# EAGLE design dot_matrix (EAGLE 5.07)
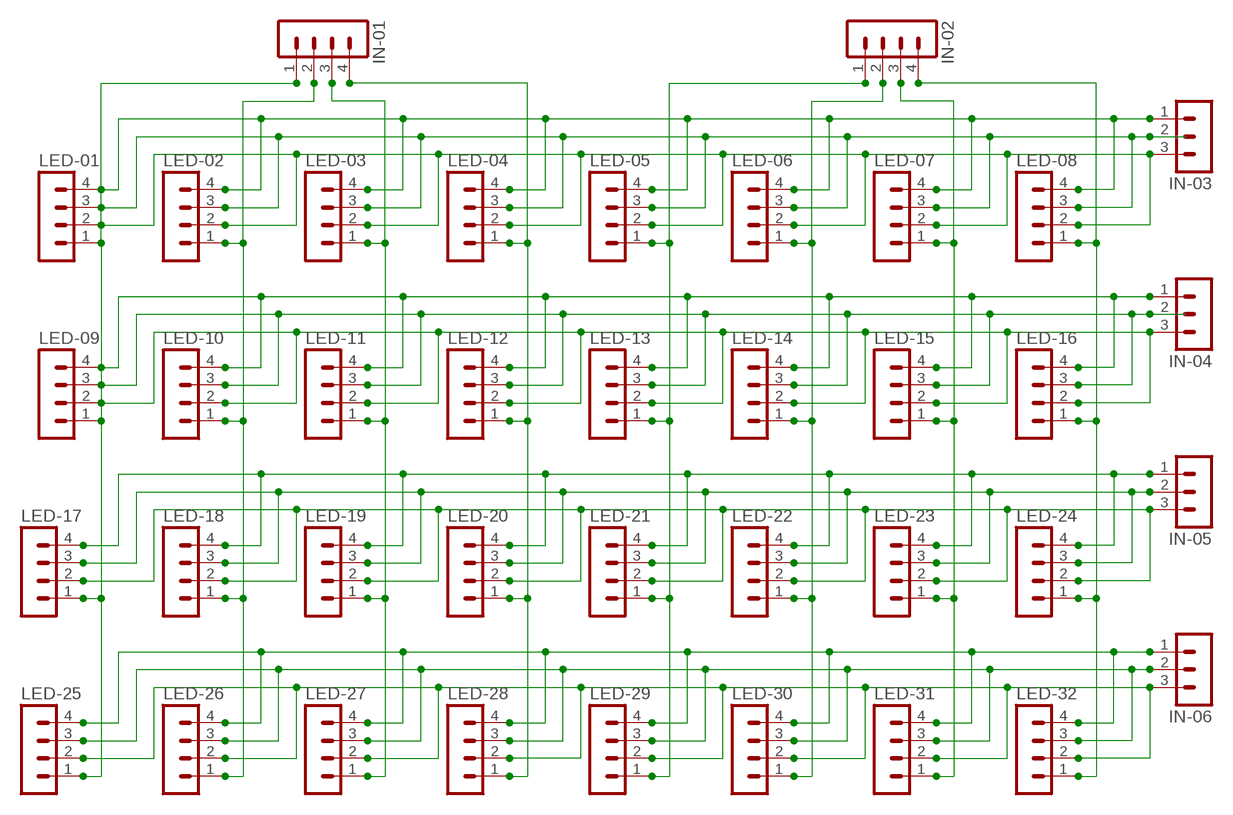
[diagram p0: schematic, sheet 1]

## Parts
IN-01  MA04-1  [MA04-1]
IN-02  MA04-1  [MA04-1]
IN-03  MA03-1  [MA03-1]
IN-04  MA03-1  [MA03-1]
IN-05  MA03-1  [MA03-1]
IN-06  MA03-1  [MA03-1]
LED-01  MA04-1  [MA04-1]
LED-02  MA04-1  [MA04-1]
LED-03  MA04-1  [MA04-1]
LED-04  MA04-1  [MA04-1]
LED-05  MA04-1  [MA04-1]
LED-06  MA04-1  [MA04-1]
LED-07  MA04-1  [MA04-1]
LED-08  MA04-1  [MA04-1]
LED-09  MA04-1  [MA04-1]
LED-10  MA04-1  [MA04-1]
LED-11  MA04-1  [MA04-1]
LED-12  MA04-1  [MA04-1]
LED-13  MA04-1  [MA04-1]
LED-14  MA04-1  [MA04-1]
LED-15  MA04-1  [MA04-1]
LED-16  MA04-1  [MA04-1]
LED-17  MA04-1  [MA04-1]
LED-18  MA04-1  [MA04-1]
LED-19  MA04-1  [MA04-1]
LED-20  MA04-1  [MA04-1]
LED-21  MA04-1  [MA04-1]
LED-22  MA04-1  [MA04-1]
LED-23  MA04-1  [MA04-1]
LED-24  MA04-1  [MA04-1]
LED-25  MA04-1  [MA04-1]
LED-26  MA04-1  [MA04-1]
LED-27  MA04-1  [MA04-1]
LED-28  MA04-1  [MA04-1]
LED-29  MA04-1  [MA04-1]
LED-30  MA04-1  [MA04-1]
LED-31  MA04-1  [MA04-1]
LED-32  MA04-1  [MA04-1]

## Nets
N$1: IN-06.3 LED-25.2 LED-26.2 LED-27.2 LED-28.2 LED-29.2 LED-30.2 LED-31.2 LED-32.2
N$2: IN-03.3 LED-01.2 LED-02.2 LED-03.2 LED-04.2 LED-05.2 LED-06.2 LED-07.2 LED-08.2
N$3: IN-03.2 LED-01.3 LED-02.3 LED-03.3 LED-04.3 LED-05.3 LED-06.3 LED-07.3 LED-08.3
N$4: IN-03.1 LED-01.4 LED-02.4 LED-03.4 LED-04.4 LED-05.4 LED-06.4 LED-07.4 LED-08.4
N$5: IN-04.3 LED-09.2 LED-10.2 LED-11.2 LED-12.2 LED-13.2 LED-14.2 LED-15.2 LED-16.2
N$6: IN-01.4 LED-04.1 LED-12.1 LED-20.1 LED-28.1
N$7: IN-06.1 LED-25.4 LED-26.4 LED-27.4 LED-28.4 LED-29.4 LED-30.4 LED-31.4 LED-32.4
N$9: IN-01.2 LED-02.1 LED-10.1 LED-18.1 LED-26.1
N$12: IN-04.2 LED-09.3 LED-10.3 LED-11.3 LED-12.3 LED-13.3 LED-14.3 LED-15.3 LED-16.3
N$13: IN-01.3 LED-03.1 LED-11.1 LED-19.1 LED-27.1
N$14: IN-04.1 LED-09.4 LED-10.4 LED-11.4 LED-12.4 LED-13.4 LED-14.4 LED-15.4 LED-16.4
N$15: IN-05.3 LED-17.2 LED-18.2 LED-19.2 LED-20.2 LED-21.2 LED-22.2 LED-23.2 LED-24.2
N$16: IN-05.2 LED-17.3 LED-18.3 LED-19.3 LED-20.3 LED-21.3 LED-22.3 LED-23.3 LED-24.3
N$17: IN-05.1 LED-17.4 LED-18.4 LED-19.4 LED-20.4 LED-21.4 LED-22.4 LED-23.4 LED-24.4
N$27: IN-01.1 LED-01.1 LED-09.1 LED-17.1 LED-25.1
N$35: IN-02.1 LED-05.1 LED-13.1 LED-21.1 LED-29.1
N$36: IN-02.2 LED-06.1 LED-14.1 LED-22.1 LED-30.1
N$37: IN-02.3 LED-07.1 LED-15.1 LED-23.1 LED-31.1
N$38: IN-02.4 LED-08.1 LED-16.1 LED-24.1 LED-32.1
N$46: IN-06.2 LED-25.3 LED-26.3 LED-27.3 LED-28.3 LED-29.3 LED-30.3 LED-31.3 LED-32.3

## Library data of the parts
IN-01 IN-02 LED-01-LED-09 LED-10-LED-32 = con-lstb:MA04-1: PIN HEADER
IN-03-IN-06 = con-lstb:MA03-1: PIN HEADER

## Board
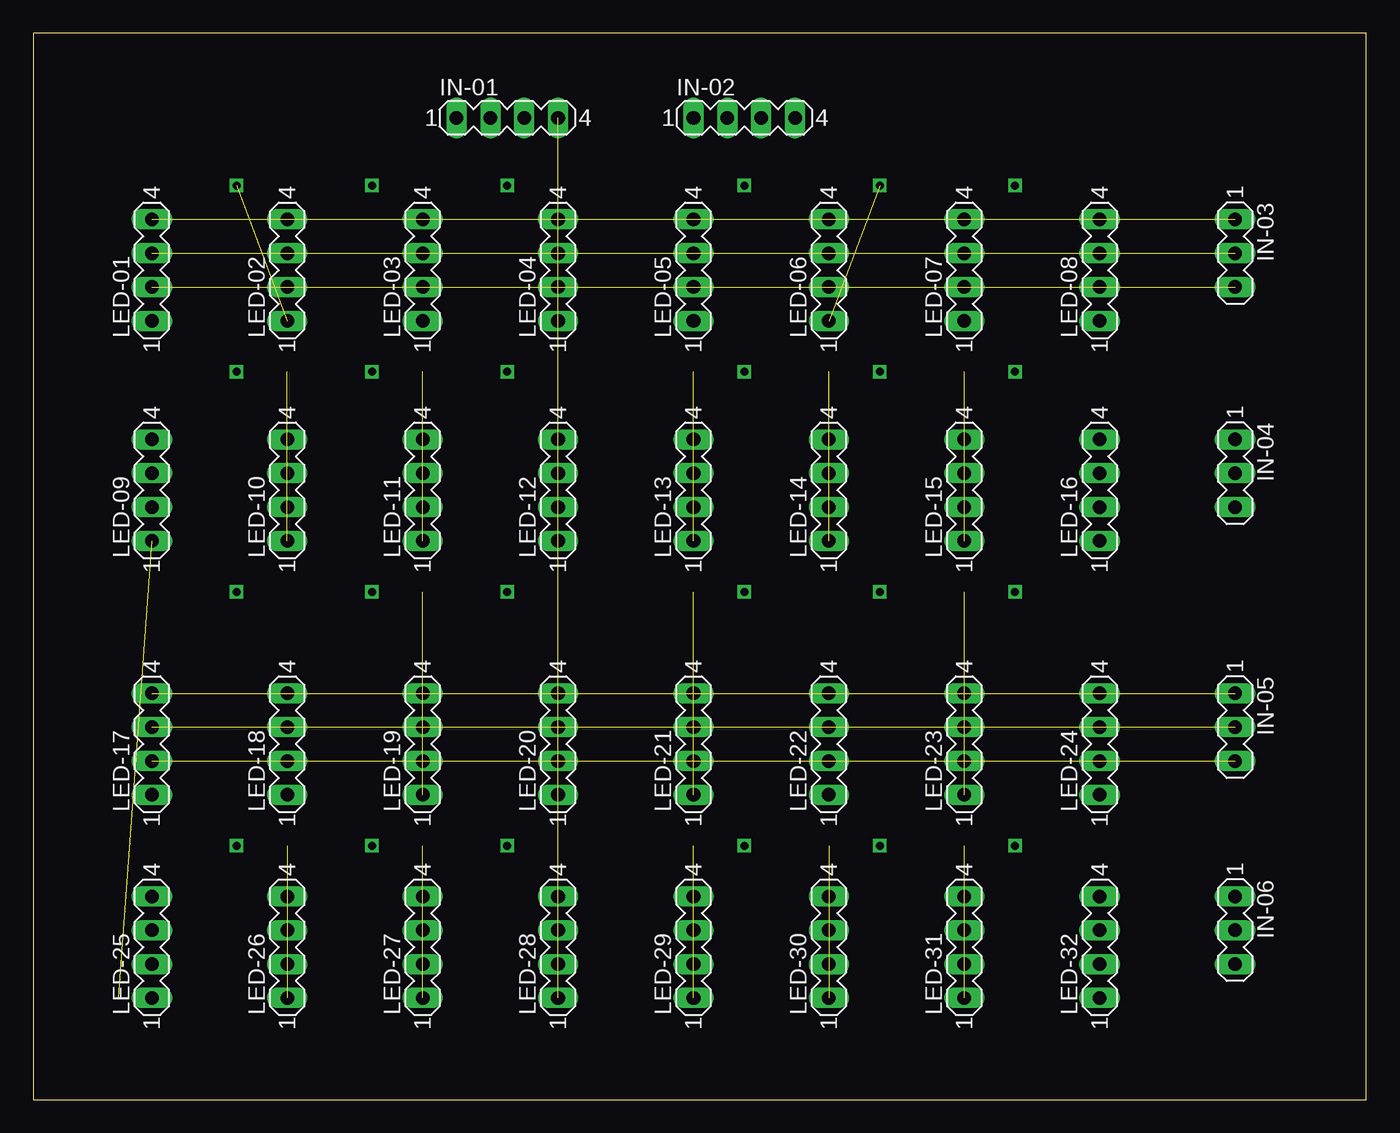
[diagram p1: board, top side]
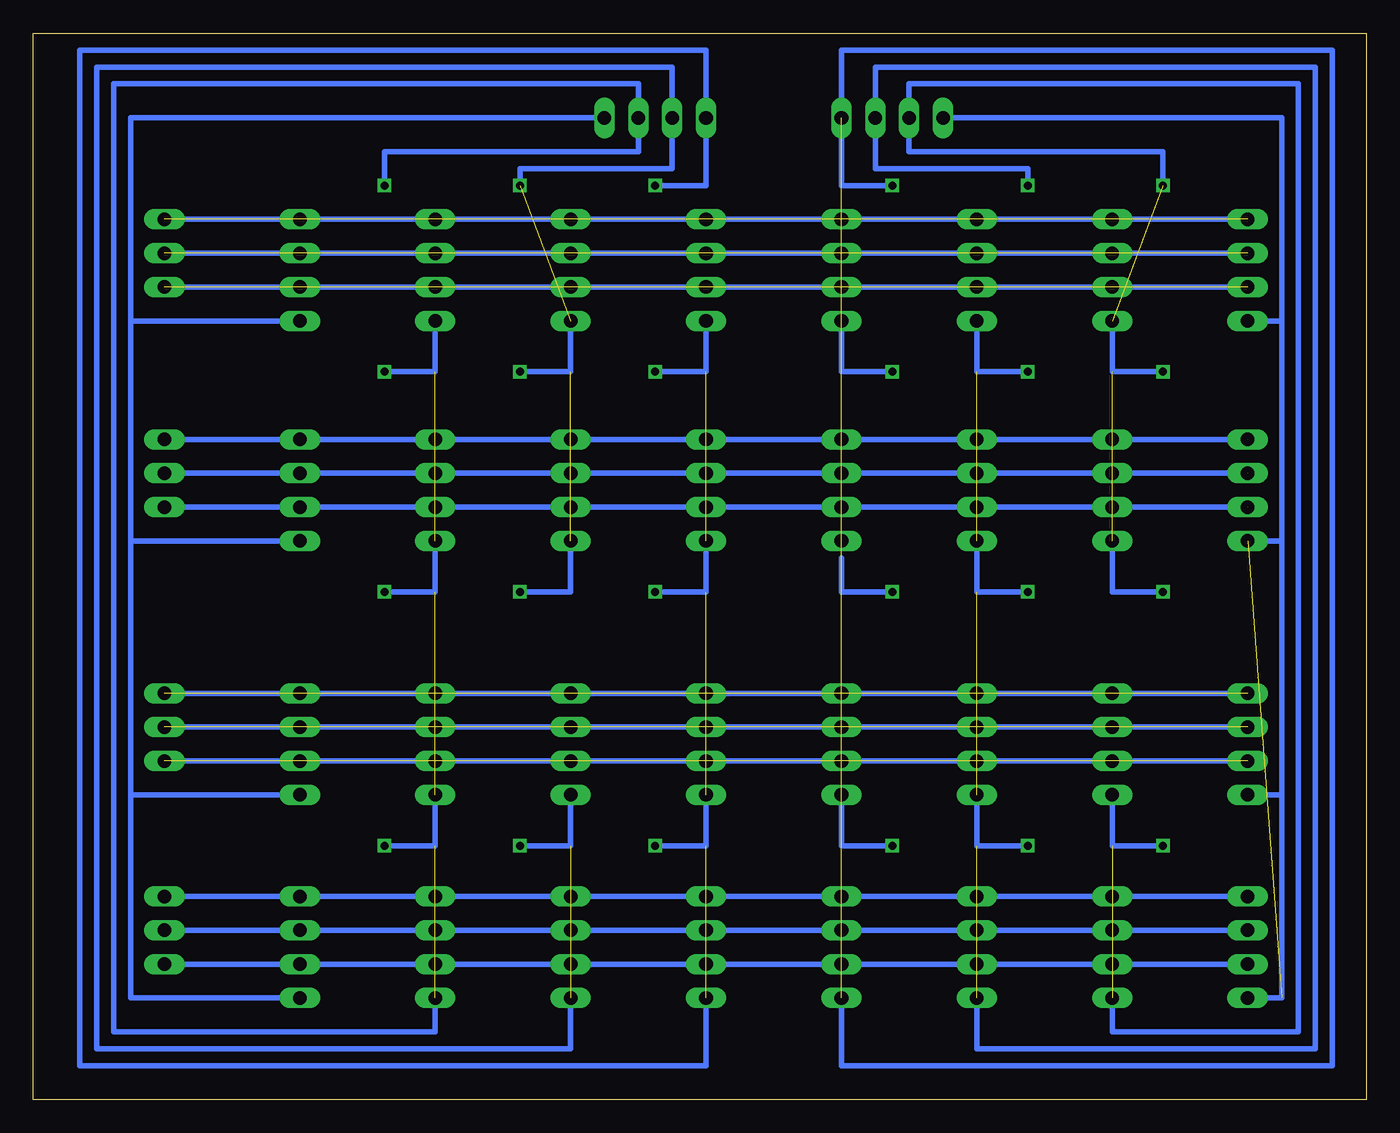
[diagram p2: board, bottom side, seen from below]

Size 100 x 80 mm. Coordinates in mm from the lower left corner, seen from the top.
Outline: 0,0 100,0 100,80 0,80 0,0
Copper layers (1*16): Top 0.035mm / dielectric 1.5mm / Bottom 0.035mm
Design rules "default": minimum track width 10mil, minimum drill 24mil, track to track 8mil, track to pad 8mil, pad to pad 8mil, via to via 8mil, smd to smd 8mil, copper to edge 40mil, drill to drill 8mil, minimum pad ring 10mil, minimum via ring 8mil, stop-mask expansion 4mil, vias tented up to drill 0mil, thermal gap 10mil

### Footprints (pad centres in the part's own frame; a part is rotated, then mirrored left to right if it is on the bottom)
MA04-1 = drill 1.016 long: 1 -3.81,0; 2 -1.27,0; 3 1.27,0; 4 3.81,0
MA03-1 = drill 1.016 long: 1 -2.54,0; 2 0,0; 3 2.54,0

### Placement (x,y rotation side)
IN-01  35.56,73.66 0 top
IN-02  53.34,73.66 0 top
IN-03  90.17,63.5 270 top
IN-04  90.17,46.99 270 top
IN-05  90.17,27.94 270 top
IN-06  90.17,12.7 270 top
LED-01  8.89,62.23 90 top
LED-02  19.05,62.23 90 top
LED-03  29.21,62.23 90 top
LED-04  39.37,62.23 90 top
LED-05  49.53,62.23 90 top
LED-06  59.69,62.23 90 top
LED-07  69.85,62.23 90 top
LED-08  80.01,62.23 90 top
LED-09  8.89,45.72 90 top
LED-10  19.05,45.72 90 top
LED-11  29.21,45.72 90 top
LED-12  39.37,45.72 90 top
LED-13  49.53,45.72 90 top
LED-14  59.69,45.72 90 top
LED-15  69.85,45.72 90 top
LED-16  80.01,45.72 90 top
LED-17  8.89,26.67 90 top
LED-18  19.05,26.67 90 top
LED-19  29.21,26.67 90 top
LED-20  39.37,26.67 90 top
LED-21  49.53,26.67 90 top
LED-22  59.69,26.67 90 top
LED-23  69.85,26.67 90 top
LED-24  80.01,26.67 90 top
LED-25  8.89,11.43 90 top
LED-26  19.05,11.43 90 top
LED-27  29.21,11.43 90 top
LED-28  39.37,11.43 90 top
LED-29  49.53,11.43 90 top
LED-30  59.69,11.43 90 top
LED-31  69.85,11.43 90 top
LED-32  80.01,11.43 90 top

### Tracks (layer width: path | path; a pad name or v marks a point on that pad's centre or on a via)
N$1
  Bottom 0.406: LED-25.2 LED-26.2 LED-27.2 LED-28.2 LED-29.2 LED-30.2 LED-31.2 LED-32.2 IN-06.3
N$2  (8 unrouted)
  Bottom 0.406: IN-03.3 LED-08.2 LED-07.2 LED-06.2 LED-05.2 LED-04.2 LED-03.2 LED-02.2 LED-01.2
N$3  (8 unrouted)
  Bottom 0.406: IN-03.2 LED-08.3 LED-07.3 LED-06.3 LED-05.3 LED-04.3 LED-03.3 LED-02.3 LED-01.3
N$4  (8 unrouted)
  Bottom 0.406: LED-01.4 LED-02.4 LED-03.4 LED-04.4 LED-05.4 LED-06.4 LED-07.4 LED-08.4 IN-03.1
N$5  (1 unrouted)
  Bottom 0.406: LED-09.2 LED-10.2 LED-11.2 LED-12.2 LED-13.2 LED-14.2 LED-15.2 LED-16.2 IN-04.3
N$6  (via drill 0.6)  (4 unrouted)
  Bottom 0.406: v35.56,68.58 39.37,68.58 IN-01.4 39.37,78.74 2.54,78.74 2.54,2.54 39.37,2.54 LED-28.1 | LED-04.1 39.37,54.61 v35.56,54.61 | LED-20.1 39.37,19.05 v35.56,19.05
N$7
  Bottom 0.406: LED-25.4 LED-26.4 LED-27.4 LED-28.4 LED-29.4 LED-30.4 LED-31.4 LED-32.4 IN-06.1
N$8  (via drill 0.6)
  Bottom 0.406: 39.37,40.64 39.37,38.1 v35.56,38.1
N$9  (via drill 0.6)  (3 unrouted)
  Bottom 0.406: v15.24,68.58 15.24,71.12 34.29,71.12 IN-01.2 34.29,76.2 5.08,76.2 5.08,5.08 19.05,5.08 LED-26.1 | LED-02.1 19.05,54.61 v15.24,54.61 | LED-18.1 19.05,19.05 v15.24,19.05 | LED-10.1 19.05,38.1 v15.24,38.1
N$11  (via drill 0.6)
  Bottom 0.406: 54.61,72.39 54.61,71.12 73.66,71.12 v73.66,68.58
N$12  (1 unrouted)
  Bottom 0.406: LED-09.3 LED-10.3 LED-11.3 LED-12.3 LED-13.3 LED-14.3 LED-15.3 LED-16.3 IN-04.2
N$13  (via drill 0.6)  (3 unrouted)
  Bottom 0.406: v25.4,68.58 25.4,69.85 36.83,69.85 IN-01.3 36.83,77.47 3.81,77.47 3.81,3.81 29.21,3.81 LED-27.1 | LED-03.1 29.21,54.61 v25.4,54.61 | LED-19.1 29.21,19.05 v25.4,19.05 | LED-11.1 29.21,38.1 v25.4,38.1
N$14  (1 unrouted)
  Bottom 0.406: LED-09.4 LED-10.4 LED-11.4 LED-12.4 LED-13.4 LED-14.4 LED-15.4 LED-16.4 IN-04.1
N$15  (8 unrouted)
  Bottom 0.406: LED-17.2 LED-18.2 | IN-05.3 LED-24.2 LED-23.2 | LED-23.2 76.2,25.4 | LED-23.2 LED-22.2 LED-21.2 LED-20.2 LED-19.2 16.51,25.4
N$16  (8 unrouted)
  Bottom 0.406: LED-17.3 LED-18.3 LED-19.3 LED-20.3 LED-21.3 | LED-21.3 54.61,27.94 | LED-21.3 LED-22.3 LED-23.3 LED-24.3 IN-05.2
N$17  (8 unrouted)
  Bottom 0.406: LED-17.4 LED-18.4 LED-19.4 LED-20.4 LED-21.4 LED-22.4 LED-23.4 LED-24.4 IN-05.1
N$19  (via drill 0.6)
  Bottom 0.406: 49.53,72.39 49.53,68.58 v53.34,68.58
N$27  (1 unrouted)
  Bottom 0.406: IN-01.1 6.35,73.66 6.35,58.42 | 6.35,58.42 LED-01.1 | 6.35,41.91 6.35,58.42 | 6.35,41.91 LED-09.1 | 6.35,22.86 6.35,41.91 | 6.35,22.86 LED-17.1 | 6.35,22.86 6.35,7.62 LED-25.1
N$35  (via drill 0.6)  (3 unrouted)
  Bottom 0.406: IN-02.1 49.53,78.74 96.52,78.74 96.52,2.54 49.53,2.54 LED-29.1 | LED-05.1 49.53,54.61 v53.34,54.61 | LED-21.1 49.53,19.05 v53.34,19.05 | LED-13.1 49.53,38.1 v53.34,38.1
N$36  (via drill 0.6)  (3 unrouted)
  Bottom 0.406: LED-30.1 59.69,3.81 95.25,3.81 95.25,77.47 52.07,77.47 IN-02.2 52.07,69.85 63.5,69.85 v63.5,68.58 | LED-06.1 59.69,54.61 v63.5,54.61 | LED-22.1 59.69,19.05 v63.5,19.05 | LED-14.1 59.69,38.1 v63.5,38.1
N$37  (via drill 0.6)  (3 unrouted)
  Bottom 0.406: LED-31.1 69.85,5.08 93.98,5.08 93.98,76.2 54.61,76.2 IN-02.3 | LED-07.1 69.85,54.61 v73.66,54.61 | LED-23.1 69.85,19.05 v73.66,19.05 | LED-15.1 69.85,38.1 v73.66,38.1
N$38
  Bottom 0.406: IN-02.4 92.71,73.66 92.71,58.42 | 92.71,58.42 LED-08.1 | 92.71,41.91 92.71,58.42 | 92.71,41.91 LED-16.1 | 92.71,22.86 92.71,41.91 | 92.71,22.86 LED-24.1 | 92.71,22.86 92.71,7.62 LED-32.1
N$46
  Bottom 0.406: LED-25.3 LED-26.3 LED-27.3 LED-28.3 LED-29.3 LED-30.3 LED-31.3 LED-32.3 IN-06.2